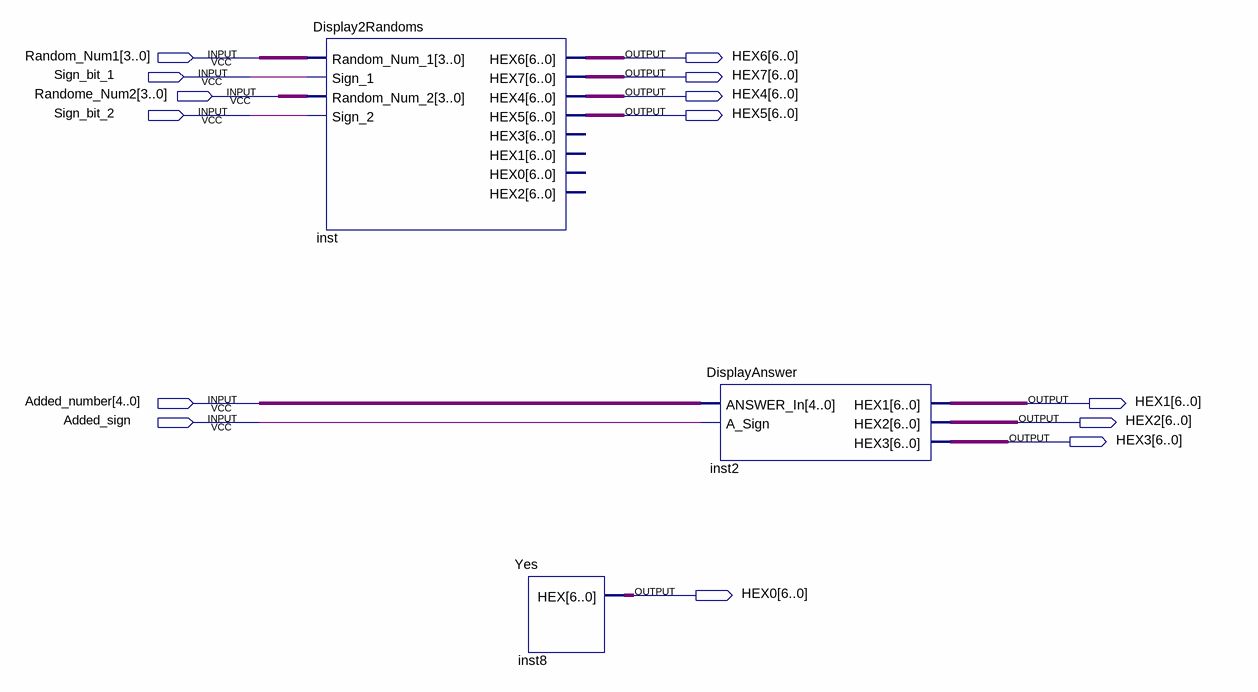
[diagram p0: schematic sheet]
// Quartus schematic DisplayCorrectAnswer.bdf as structural Verilog: 3 symbols, 14 pins
module DisplayCorrectAnswer (
  input  [3:0] Random_Num1,
  input  Sign_bit_1,
  input  [3:0] Randome_Num2,
  input  Sign_bit_2,
  input  [4:0] Added_number,
  input  Added_sign,
  output [6:0] HEX6,
  output [6:0] HEX7,
  output [6:0] HEX4,
  output [6:0] HEX5,
  output [6:0] HEX1,
  output [6:0] HEX2,
  output [6:0] HEX3,
  output [6:0] HEX0
);

  Display2Randoms inst (
    .Random_Num_1(Random_Num1), .Sign_1(Sign_bit_1), .Random_Num_2(Randome_Num2), .Sign_2(Sign_bit_2),
    .HEX6(HEX6), .HEX7(HEX7), .HEX4(HEX4), .HEX5(HEX5));  // open: HEX3, HEX1, HEX0, HEX2
  Yes inst8 (.HEX(HEX0));
  DisplayAnswer inst2 (.ANSWER_In(Added_number), .A_Sign(Added_sign), .HEX1(HEX1), .HEX2(HEX2), .HEX3(HEX3));
endmodule
